# Altium project linecarc20_balancing.PrjPcb
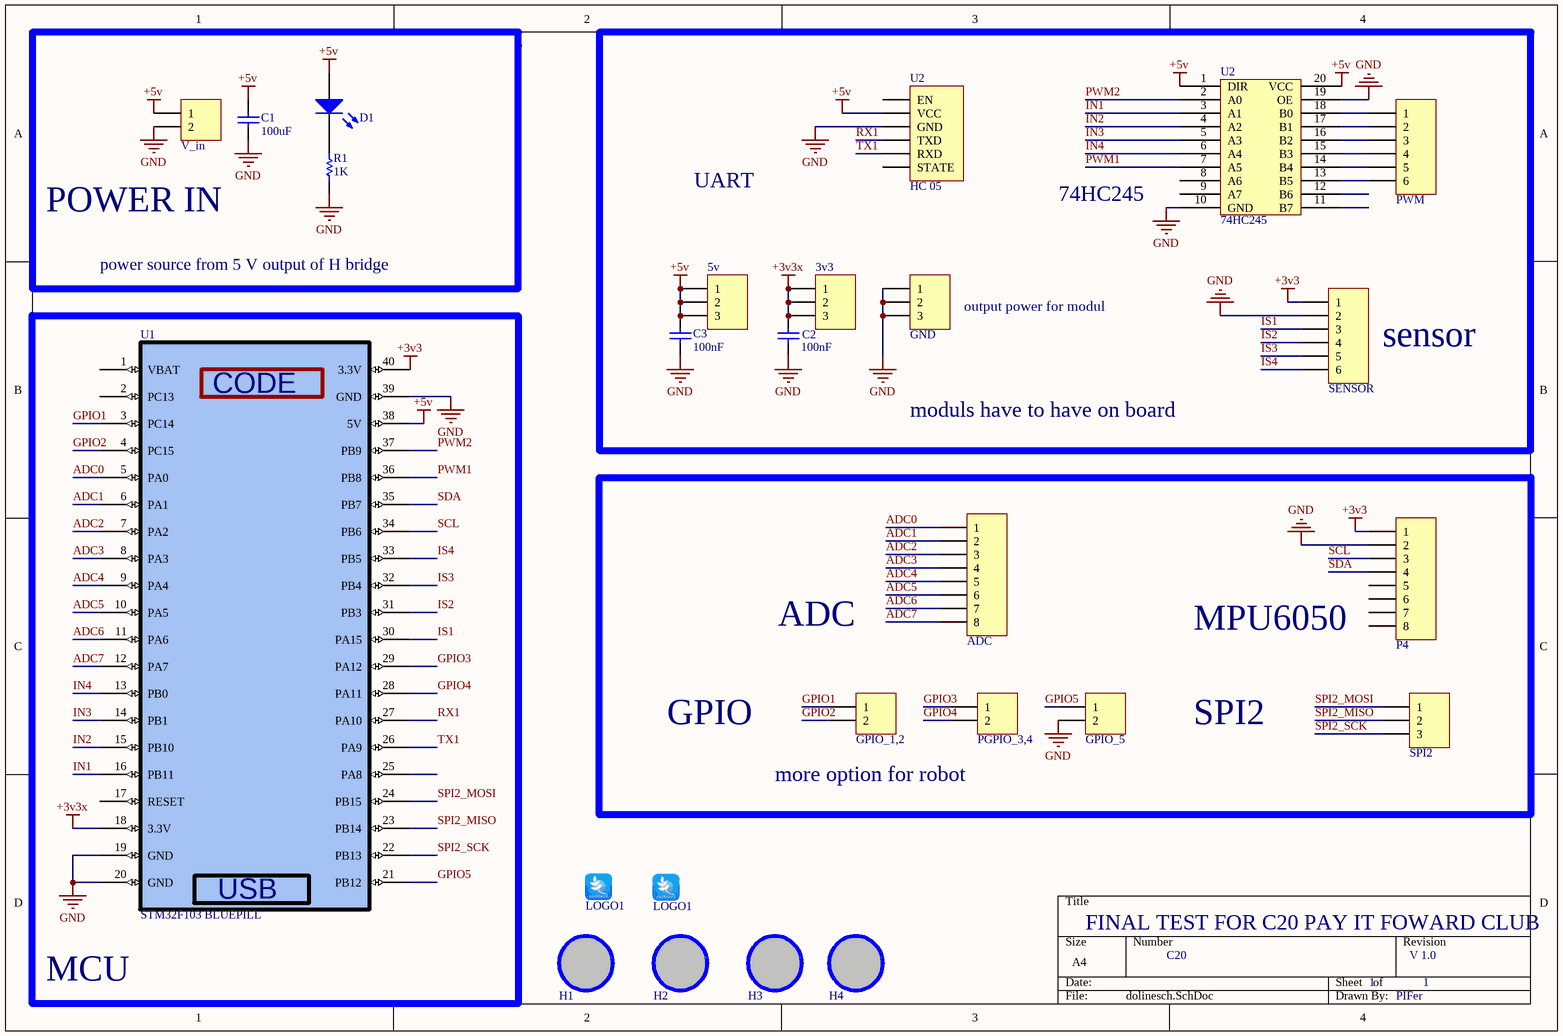
[diagram p0: dolinesch.SchDoc]
1 sheet, 26 parts. Net scope: global (net labels, ports and power ports of the same name join across sheets).
Board file: dolinepcb.PcbDoc

## Sheet dolinesch.SchDoc: LINE FOLLOWING ROBOT
size A4; Address1: PAY IT FOWARD CLUB; Address2: C20 FINAL TEST; Address3: PAGE 1/1; Time: 2:57:37 PM

### Parts
(Parts that share a designator on the sheet are numbered #1, #2 ... from top to bottom, then left to right.)
3v3  Header 3  [JP3]  (value not drawn)
5v  Header 3  [JP3]  (value not drawn)
ADC  Header 8  [JP8]  (value not drawn)
C1  value 100uF  [CAP-SM-0805]  (hidden comment: Cap Non-Pol SMD)
C2  value 100nF  [CAP-SM-0805]  (hidden comment: Cap Non-Pol SMD)
C3  value 100nF  [CAP-SM-0805]  (hidden comment: Cap Non-Pol SMD)
D1  LED  [LED-3mm]  (value not drawn)
GND  Header 3  [JP3]  (value not drawn)
GPIO_1,2  Header 2  [JP2]  (value not drawn)
GPIO_5  Header 2  [JP2]  (value not drawn)
H1  Hole  [LO KHOAN 3MM]  (value not drawn)
H2  Hole  [LO KHOAN 3MM]  (value not drawn)
H3  Hole  [LO KHOAN 3MM]  (value not drawn)
H4  Hole  [LO KHOAN 3MM]  (value not drawn)
LOGO1#1  LOGO PIF  [PIF LOGO TOP OVERLAY]  (value not drawn)
LOGO1#2  LOGO PIF  [PIF LOGO TOP OVERLAY]  (value not drawn)
P4  Header 8  [JP8]  (value not drawn)
PGPIO_3,4  Header 2  [JP2]  (value not drawn)
PWM  Header 6  [JP6]  (value not drawn)
R1  value 1K  [RES-SM-0603]  (hidden comment: RESISTOR SMD)
SENSOR  Header 6  [JP6]  (value not drawn)
SPI2  Header 3  [JP3]  (value not drawn)
U1  STM32F103 BLUEPILL  [STM32F103 Bluepill]
U2#1  74HC245  [DIP20/W0.3]
U2#2  HC 05  [JP6]
V_in  Domino 2  [DOMINO 2- 5mm]  (value not drawn)

### Blocks framed on the sheet
sensor: 3v3 5v C2 C3 GND PWM SENSOR U2#1 U2#2
MCU: U1

### Nets
+3v3: P4.1 SENSOR.1 U1.40(3.3V)
+3v3x: 3v3.1 3v3.2 3v3.3 C2.2 U1.18(3.3V)
+5v: 5v.1 5v.2 5v.3 C1.2 C3.2 D1.1(A) U1.38(5V) U2#1.1(DIR) U2#1.20(VCC) U2#2.2(VCC) V_in.1
GND: C1.1 C2.1 C3.1 GND.1 GND.2 GND.3 GPIO_5.2 P4.2 R1.2 SENSOR.2 U1.19(GND) U1.20(GND) U1.39(GND) U2#1.10(GND) U2#1.19(OE) U2#2.3(GND) V_in.2
ADC0: ADC.1 U1.5(PA0)
ADC1: ADC.2 U1.6(PA1)
ADC2: ADC.3 U1.7(PA2)
ADC3: ADC.4 U1.8(PA3)
ADC4: ADC.5 U1.9(PA4)
ADC5: ADC.6 U1.10(PA5)
ADC6: ADC.7 U1.11(PA6)
ADC7: ADC.8 U1.12(PA7)
GPIO1: GPIO_1,2.1 U1.3(PC14)
GPIO2: GPIO_1,2.2 U1.4(PC15)
GPIO3: PGPIO_3,4.1 U1.29(PA12)
GPIO4: PGPIO_3,4.2 U1.28(PA11)
GPIO5: GPIO_5.1 U1.21(PB12)
IN1: U1.16(PB11) U2#1.3(A1)
IN2: U1.15(PB10) U2#1.4(A2)
IN3: U1.14(PB1) U2#1.5(A3)
IN4: U1.13(PB0) U2#1.6(A4)
IS1: SENSOR.3 U1.30(PA15)
IS2: SENSOR.4 U1.31(PB3)
IS3: SENSOR.5 U1.32(PB4)
IS4: SENSOR.6 U1.33(PB5)
PWM1: U1.36(PB8) U2#1.7(A5)
PWM2: U1.37(PB9) U2#1.2(A0)
RX1: U1.27(PA10) U2#2.4(TXD)
SCL: P4.3 U1.34(PB6)
SDA: P4.4 U1.35(PB7)
SPI2_MISO: SPI2.2 U1.23(PB14)
SPI2_MOSI: SPI2.1 U1.24(PB15)
SPI2_SCK: SPI2.3 U1.22(PB13)
TX1: U1.26(PA9) U2#2.5(RXD)
NetD1_2: D1.2(K) R1.1
NetPWM_1: PWM.1 U2#1.18(B0)
NetPWM_2: PWM.2 U2#1.17(B1)
NetPWM_3: PWM.3 U2#1.16(B2)
NetPWM_4: PWM.4 U2#1.15(B3)
NetPWM_5: PWM.5 U2#1.14(B4)
NetPWM_6: PWM.6 U2#1.13(B5)

Not connected (* = marked no-connect by the designer): H1 1; H2 1; H3 1; H4 1; P4 5 6 7 8; U1 1(VBAT) 2(PC13) 17(RESET) 25(PA8); U2#1 8(A6) 9(A7) 11(B7) 12(B6); U2#2 1(EN) 6(STATE)

### Notes on the sheet
- POWER IN
- UART
- 74HC245
- power source from 5 V output of H bridge
- output power for modul
- moduls have to have on board
- ADC
- MPU6050
- GPIO
- more option for robot
- SPI2
- FINAL TEST FOR C20 PAY IT FOWARD CLUB
- C20
- 1
- V 1.0
- PIFer
- Title
- Size:
- Date:
- A4
- Number:
- Time:
- Revision:
- Sheet
- of
- File:
- (in symbol STM32F103 BLUEPILL) CODE; USB

### Library data of the parts
3v3 5v GND SPI2 = Header 3: Header, 3-Pin; LatestRevisionDate: 17-Jul-2002; LatestRevisionNote: Re-released for DXP Platform.; Publisher: Altium Limited
ADC P4 = Header 8: Header, 8-Pin; LatestRevisionDate: 17-Jul-2002; LatestRevisionNote: Re-released for DXP Platform.; Publisher: Altium Limited
C1-C3 = Cap Non-Pol SMD: Capacitor
GPIO_1,2 GPIO_5 PGPIO_3,4 = Header 2: Header, 2-Pin; LatestRevisionDate: 17-Jul-2002; LatestRevisionNote: Re-released for DXP Platform.; Publisher: Altium Limited
H1-H4 = Hole: Hole 3mm
LOGO1#1 LOGO1#2 = LOGO PIF_2
PWM SENSOR = Header 6: Header, 6-Pin; LatestRevisionDate: 17-Jul-2002; LatestRevisionNote: Re-released for DXP Platform.; Publisher: Altium Limited
R1 = RESISTOR SMD: Resistor
U2#1 = 74HC245: Octal bus tranceiver
V_in = Domino 2: Domino, 2-Pin; LatestRevisionDate: 17-Jul-2002; LatestRevisionNote: Re-released for DXP Platform.; Publisher: Altium Limited